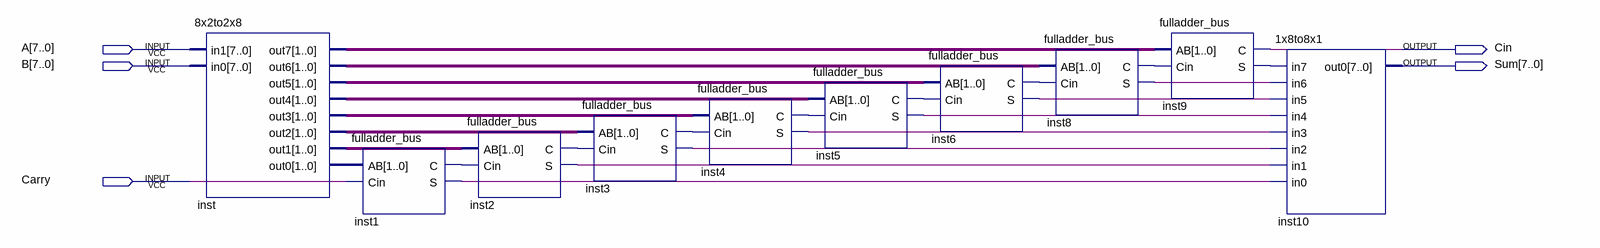
[diagram p0: schematic sheet]
// Quartus schematic 8fullAdder.bdf as structural Verilog: 10 symbols, 5 pins
module \8fullAdder  (
  input  [7:0] A,
  input  [7:0] B,
  input  Carry,
  output Cin,
  output [7:0] Sum
);

  wire inst1_c, inst1_s, inst2_c, inst2_s, inst3_c, inst3_s, inst4_c, inst4_s, inst5_c, inst5_s, inst6_c,
       inst6_s, inst8_c, inst8_s, inst9_s;
  wire [1:0] inst_out0, inst_out1, inst_out2, inst_out3, inst_out4, inst_out5, inst_out6, inst_out7;

  \8x2to2x8  inst (
    .in1(A), .in0(B), .out7(inst_out7), .out6(inst_out6), .out5(inst_out5), .out4(inst_out4),
    .out3(inst_out3), .out2(inst_out2), .out1(inst_out1), .out0(inst_out0));
  fulladder_bus inst1 (.AB(inst_out0), .Cin(Carry), .C(inst1_c), .S(inst1_s));
  fulladder_bus inst2 (.AB(inst_out1), .Cin(inst1_c), .C(inst2_c), .S(inst2_s));
  fulladder_bus inst3 (.AB(inst_out2), .Cin(inst2_c), .C(inst3_c), .S(inst3_s));
  fulladder_bus inst4 (.AB(inst_out3), .Cin(inst3_c), .C(inst4_c), .S(inst4_s));
  fulladder_bus inst5 (.AB(inst_out4), .Cin(inst4_c), .C(inst5_c), .S(inst5_s));
  fulladder_bus inst6 (.AB(inst_out5), .Cin(inst5_c), .C(inst6_c), .S(inst6_s));
  fulladder_bus inst8 (.AB(inst_out6), .Cin(inst6_c), .C(inst8_c), .S(inst8_s));
  fulladder_bus inst9 (.AB(inst_out7), .Cin(inst8_c), .C(Cin), .S(inst9_s));
  \1x8to8x1  inst10 (
    .in7(inst9_s), .in6(inst8_s), .in5(inst6_s), .in4(inst5_s), .in3(inst4_s), .in2(inst3_s), .in1(inst2_s),
    .in0(inst1_s), .out0(Sum));
endmodule
